# EAGLE design edcs_b (EAGLE 5.09)
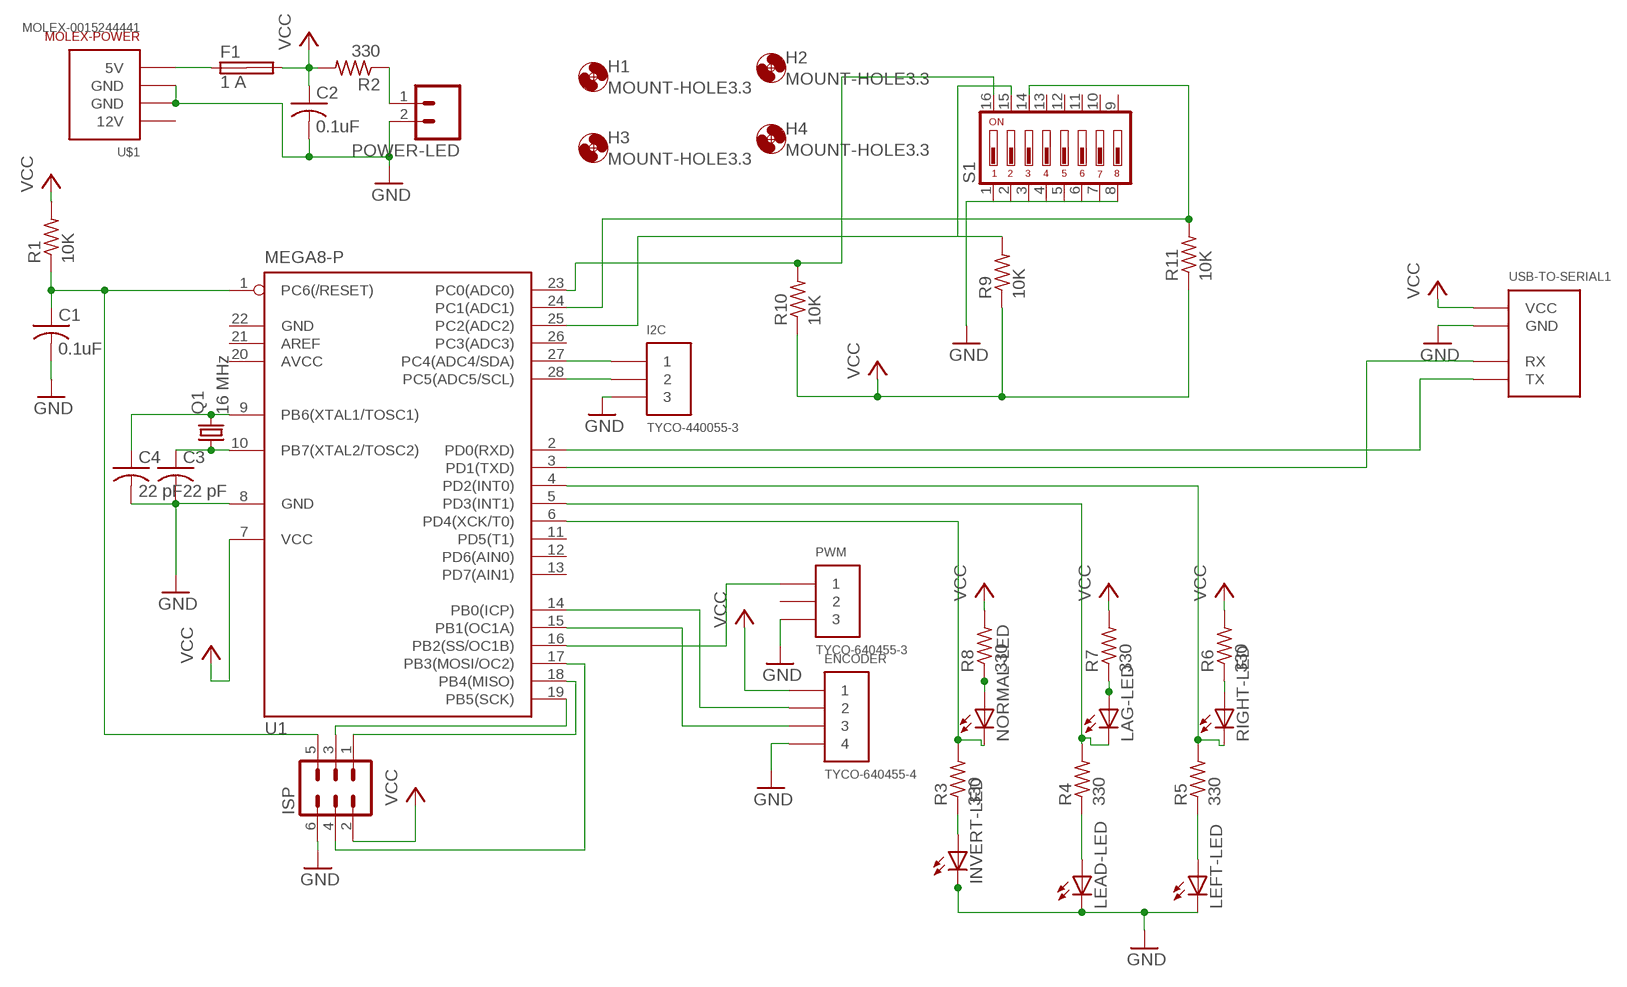
[diagram p0: schematic, sheet 1]

## Parts
C1  0.1uF  C-US050-055X075  [C050-055X075]
C2  0.1uF  C-US050-055X075  [C050-055X075]
C3  22 pF  C-US025-025X050  [C025-025X050]
C4  22 pF  C-US025-025X050  [C025-025X050]
ENCODER  TYCO-640455-4  [HEADER-RA-POL-.100IN-4]
F1  1 A  SHK20Q  [SHK20Q]
H1  MOUNT-HOLE3.3  [3,3]
H2  MOUNT-HOLE3.3  [3,3]
H3  MOUNT-HOLE3.3  [3,3]
H4  MOUNT-HOLE3.3  [3,3]
I2C  TYCO-440055-3  [HEADER-RA-2.00MM-3]
INVERT-LED  LED3MM  [LED3MM]
ISP  MA03-2  [MA03-2]
LAG-LED  LED3MM  [LED3MM]
LEAD-LED  LED3MM  [LED3MM]
LEFT-LED  LED3MM  [LED3MM]
NORMAL-LED  LED3MM  [LED3MM]
POWER-LED  M02POLAR  [MOLEX-1X2]
PWM  TYCO-640455-3  [HEADER-RA-POL-.100IN-3]
Q1  16 MHz  CRYSTALHC49S  [HC49/S]
R1  10K  R-US_0207/10  [0207/10]
R2  330  R-US_0207/10  [0207/10]
R3  330  R-US_0207/10  [0207/10]
R4  330  R-US_0207/10  [0207/10]
R5  330  R-US_0207/10  [0207/10]
R6  330  R-US_0207/10  [0207/10]
R7  330  R-US_0207/10  [0207/10]
R8  330  R-US_0207/10  [0207/10]
R9  10K  R-US_0207/10  [0207/10]
R10  10K  R-US_0207/10  [0207/10]
R11  10K  R-US_0207/10  [0207/10]
RIGHT-LED  LED3MM  [LED3MM]
S1  DIP08YL  [DIP08YL]
U1  MEGA8-P  [DIL28-3]
U$1  MOLEX-0015244441  [MOLEX-0015244441B]
USB-TO-SERIAL1  USB-TO-SERIAL-SQUARE  [USB-TO-SERIAL.SQUARE]

## Nets
GND: C1.2 C2.2 C3.2 C4.2 ENCODER.4 I2C.3 INVERT-LED.K(C) ISP.6 LEAD-LED.K(C) LEFT-LED.K(C) POWER-LED.2 PWM.3 S1.1 S1.2 S1.3 S1.4 S1.5 S1.6 S1.7 S1.8 U1.8(GND) U$1.2(GND) U$1.3(GND) USB-TO-SERIAL1.GND
N$1: C3.1 Q1.1 U1.10(PB7(XTAL2/TOSC2))
N$2: C4.1 Q1.2 U1.9(PB6(XTAL1/TOSC1))
N$3: C1.1 ISP.5 R1.1 U1.1(PC6(/RESET))
N$4: F1.1A U$1.4(5V)
N$5: ENCODER.2 U1.14(PB0(ICP))
N$6: ENCODER.3 U1.15(PB1(OC1A))
N$7: PWM.1 U1.16(PB2(SS/OC1B))
N$8: I2C.1 U1.27(PC4(ADC4/SDA))
N$9: I2C.2 U1.28(PC5(ADC5/SCL))
N$10: R9.2 S1.15 U1.25(PC2(ADC2))
N$11: R11.2 S1.14 U1.24(PC1(ADC1))
N$12: NORMAL-LED.A R8.1
N$13: R10.2 S1.16 U1.23(PC0(ADC0))
N$14: ISP.1 U1.18(PB4(MISO))
N$15: U1.2(PD0(RXD)) USB-TO-SERIAL1.TX
N$16: LAG-LED.K(C) R4.2 U1.5(PD3(INT1))
N$17: NORMAL-LED.K(C) R3.2 U1.6(PD4(XCK/T0))
N$18: LAG-LED.A R7.1
N$19: INVERT-LED.A R3.1
N$20: R5.2 RIGHT-LED.K(C) U1.4(PD2(INT0))
N$21: LEAD-LED.A R4.1
N$22: R6.1 RIGHT-LED.A
N$23: LEFT-LED.A R5.1
N$24: U1.3(PD1(TXD)) USB-TO-SERIAL1.RX
N$28: POWER-LED.1 R2.1
N$31: ISP.3 U1.19(PB5(SCK))
N$33: ISP.4 U1.17(PB3(MOSI/OC2))
VCC: C2.1 ENCODER.1 F1.2A ISP.2 R1.2 R2.2 R6.2 R7.2 R8.2 R9.1 R10.1 R11.1 U1.7(VCC) USB-TO-SERIAL1.VCC
Unconnected: F1.1B F1.2B PWM.2 S1.9 S1.10 S1.11 S1.12 S1.13 U1.11(PD5(T1)) U1.12(PD6(AIN0)) U1.13(PD7(AIN1)) U1.21(AREF) U1.26(PC3(ADC3))

## Power pins joined to a net without a drawn wire
12V: U$1.1(12V)
AVCC: U1.20(AVCC)
GND: U1.22(GND)

## Library data of the parts
C1-C4 = resistor:C-US: CAPACITOR, American symbol
ENCODER = chicagoedt:TYCO-640455-4: 4 pin right angle header with polarizing tab and .100" pitch.
F1 = fuse:SHK20Q: FUSE HOLDER 5 x 20 mm, SH contact, E1207 Buerklin 64G6061
H1-H4 = holes:MOUNT-HOLE: MOUNTING HOLE with drill center marker
I2C = chicagoedt:TYCO-440055-3: 3 pin right angle header with shroud and 2.00 mm pitch.
INVERT-LED LAG-LED LEAD-LED LEFT-LED NORMAL-LED RIGHT-LED = led:LED: LED OSRAM: - CHIPLED LG R971, LG N971, LY N971, LG Q971, LY Q971, LO R971, LY R971 LH N974, LH R974 LS Q976, LO Q976, LY Q976 LO Q996 - Hyper CHIPLED LW Q18S LB Q993, LB Q99A, LB R99A - SideLED LS A670, LO A670, LY A670, LG A670, LP A670 LB A673, LV A673, LT A673, LW A673 LH A674 LY A675 LS A676, LA A676, LO A676, LY A676, LW A676 LS A679, LY A679, LG A679 - Hyper Micro SIDELED® LS Y876, LA Y876, LO Y876, LY Y876 LT Y87S - SmartLED LW L88C, LW L88S LB L89C, LB L89S, LG L890 LS L89K, LO L89K, LY L89K LS L896, LA L896, LO L896, LY L896 - TOPLED LS T670, LO T670, LY T670, LG T670, LP T670 LSG T670, LSP T670, LSY T670, LOP T670, LYG T670 LG T671, LOG T671, LSG T671 LB T673, LV T673, LT T673, LW T673 LH T674 LS T676, LA T676, LO T676, LY T676, LB T676, LH T676, LSB T676, LW T676 LB T67C, LV T67C, LT T67C, LS T67K, LO T67K, LY T67K, LW E67C LS E67B, LA E67B, LO E67B, LY E67B, LB E67C, LV E67C, LT E67C LW T67C LS T679, LY T679, LG T679 LS T770, LO T770, LY T770, LG T770, LP T770 LB T773, LV T773, LT T773, LW T773 LH T774 LS E675, LA E675, LY E675, LS T675 LS T776, LA T776, LO T776, LY T776, LB T776 LHGB T686 LT T68C, LB T68C - Hyper Mini TOPLED® LB M676 - Mini TOPLED Santana® LG M470 LS M47K, LO M47K, LY M47K Source: http://www.osram.convergy.de LUXEON: - LUMILED® LXK2-PW12-R00, LXK2-PW12-S00, LXK2-PW14-U00, LXK2-PW14-V00 LXK2-PM12-R00, LXK2-PM12-S00, LXK2-PM14-U00 LXK2-PE12-Q00, LXK2-PE12-R00, LXK2-PE12-S00, LXK2-PE14-T00, LXK2-PE14-U00 LXK2-PB12-K00, LXK2-PB12-L00, LXK2-PB12-M00, LXK2-PB14-N00, LXK2-PB14-P00, LXK2-PB14-Q00 LXK2-PR12-L00, LXK2-PR12-M00, LXK2-PR14-Q00, LXK2-PR14-R00 LXK2-PD12-Q00, LXK2-PD12-R00, LXK2-PD12-S00 LXK2-PH12-R00, LXK2-PH12-S00 LXK2-PL12-P00, LXK2-PL12-Q00, LXK2-PL12-R00 Source: www.luxeon.com KINGBRIGHT: KA-3528ASYC Source: www.kingbright.com
ISP = con-lstb:MA03-2: PIN HEADER
POWER-LED = SparkFun:M02: Header 2 Standard 2-pin 0.1" header. Use with straight break away headers (SKU : PRT-00116), right angle break away headers (PRT-00553), swiss pins (PRT-00743), machine pins (PRT-00117), and female headers (PRT-00115). Molex polarized connector foot print use with SKU : PRT-08233 with associated crimp pins and housings.
PWM = chicagoedt:TYCO-640455-3: 3 pin right angle header with polarizing tab and .100" pitch.
Q1 = crystal:CRYSTAL: CRYSTAL
R1-R11 = resistor:R-US_: RESISTOR, American symbol
S1 = switch-dil:DIP08YL: DIL/CODE SWITCH
U1 = atmel:MEGA8-P: MICROCONTROLLER 8 Kbytes FLASH, 1 kbytes SRAM, 512 bytes EEPROM, USART, 4-channel 10 bit ADC, 2-channel 8 bit ADC Pin compatible with Atmega48, ATMega88, ATMega168 Source: avr.lbr
U$1 = chicagoedt:MOLEX-0015244441: 5.08mm (.200") Pitch Disk Drive Power Connection System Header, Right Angle, Through Hole, 4 Circuits, Lead-free, 3.56mm (.140") PC Tail Length, with PCB Locator Peg
USB-TO-SERIAL1 = chicagoedt:USB-TO-SERIAL-SQUARE

## Board
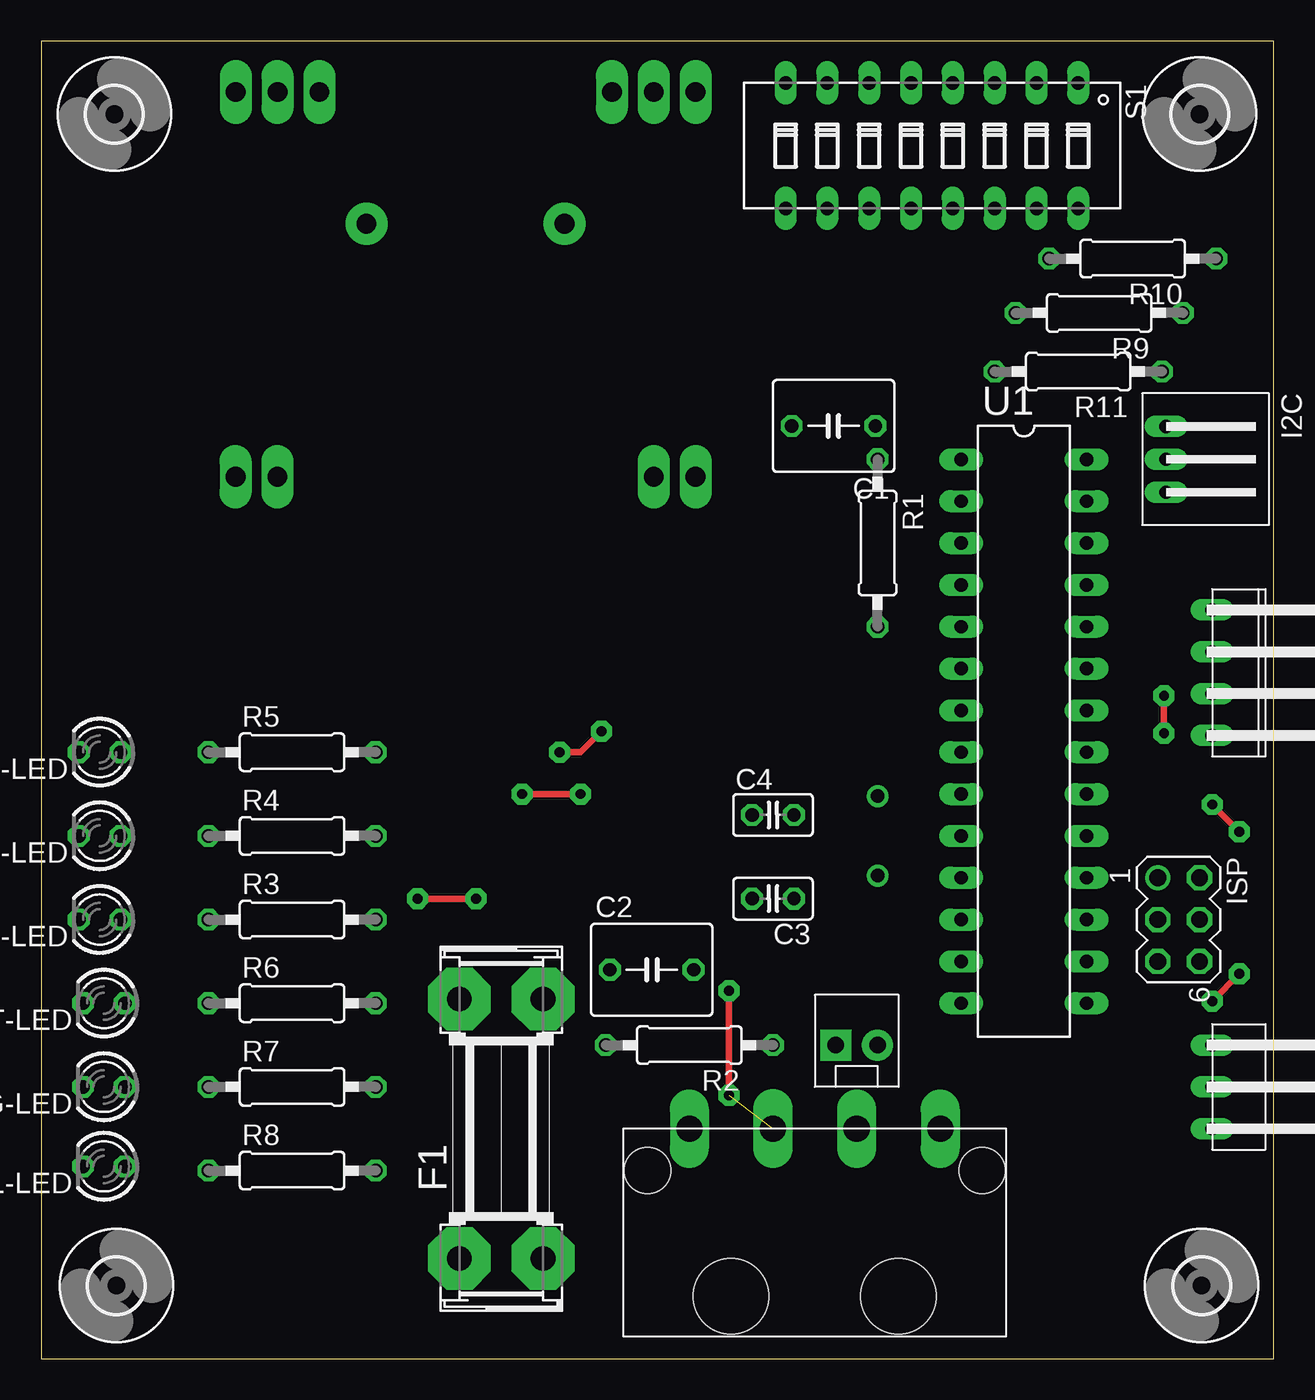
[diagram p1: board, top side]
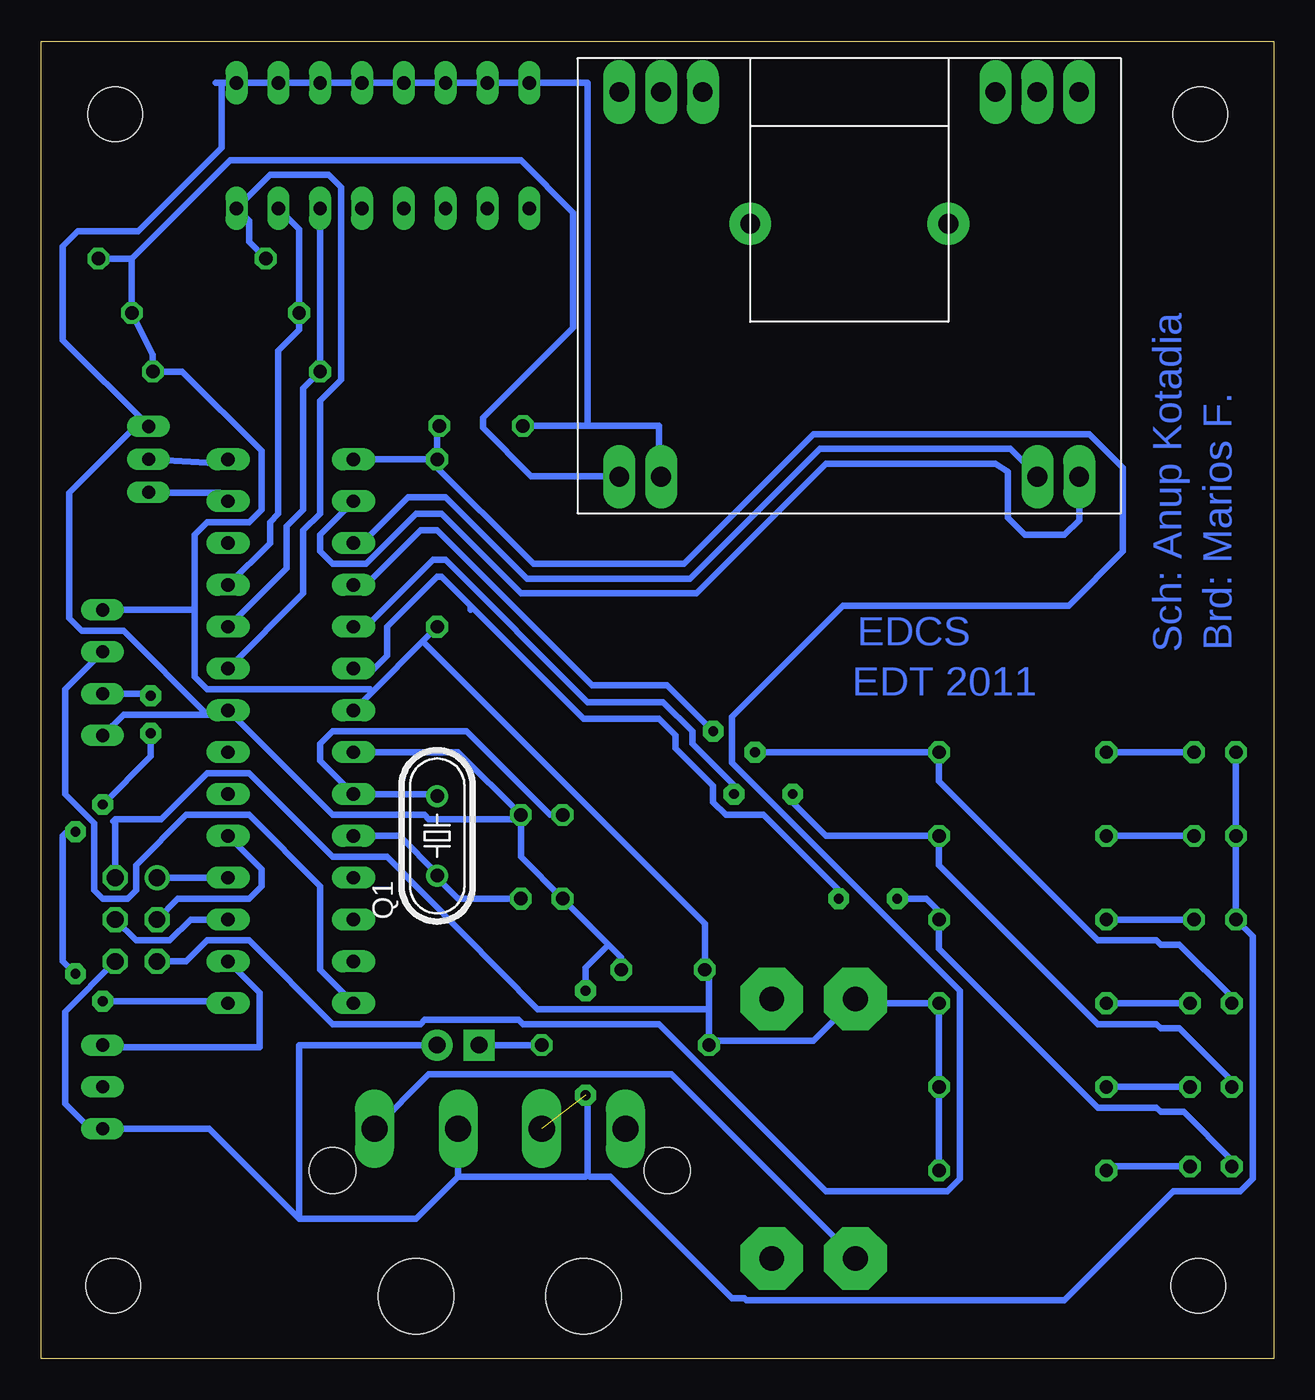
[diagram p2: board, bottom side, seen from below]

Size 74.85 x 80 mm. Coordinates in mm from the lower left corner, seen from the top.
Outline: 0,0 74.85,0 74.85,80 0,80 0,0
Copper layers (1*16): Top 0.035mm / dielectric 1.5mm / Bottom 0.035mm
Design rules "default *": minimum track width 16mil, minimum drill 24mil, track to track 16mil, track to pad 12mil, pad to pad 10mil, via to via 8mil, smd to smd 8mil, copper to edge 40mil, drill to drill 8mil, minimum pad ring 10mil, minimum via ring 8mil, stop-mask expansion 4mil, vias tented up to drill 0mil, thermal gap 10mil

### Footprints (pad centres in the part's own frame; a part is rotated, then mirrored left to right if it is on the bottom)
C050-055X075 = drill 0.813 octagon: 1 -2.54,0; 2 2.54,0
C025-025X050 = drill 0.813 octagon: 1 -1.27,0; 2 1.27,0
HEADER-RA-POL-.100IN-4 = drill 0.8 long: 1 -3.81,-5.08; 2 -1.27,-5.08; 3 1.27,-5.08; 4 3.81,-5.08
SHK20Q = drill 1.5 pad 3.81 octagon: 1A -7.874,2.54; 1B -7.874,-2.54; 2A 7.874,2.54; 2B 7.874,-2.54
3,3 = hole 3.3: 0,0
HEADER-RA-2.00MM-3 = drill 0.8 long: 1 2,0; 2 0,0; 3 -2,0
LED3MM = drill 0.813 octagon: A -1.27,0; K 1.27,0
MA03-2 = drill 1.016 round: 1 -2.54,-1.27 | drill 1.016 octagon: 2 -2.54,1.27; 3 0,-1.27; 4 0,1.27; 5 2.54,-1.27; 6 2.54,1.27
MOLEX-1X2 = drill 1.016 pad 1.88 square: 1 0,0 | drill 1.016 pad 1.88 round: 2 2.54,0
HEADER-RA-POL-.100IN-3 = drill 0.8 long: 1 -2.54,-5.08; 2 0,-5.08; 3 2.54,-5.08
HC49/S = drill 0.813 round: 1 -2.413,0; 2 2.413,0
0207/10 = drill 0.813 octagon: 1 -5.08,0; 2 5.08,0
DIP08YL = drill 0.813 long: 1 -8.89,-3.81; 2 -6.35,-3.81; 3 -3.81,-3.81; 4 -1.27,-3.81; 5 1.27,-3.81; 6 3.81,-3.81; 7 6.35,-3.81; 8 8.89,-3.81; 9 8.89,3.81; 10 6.35,3.81; 11 3.81,3.81; 12 1.27,3.81; 13 -1.27,3.81; 14 -3.81,3.81; 15 -6.35,3.81; 16 -8.89,3.81
DIL28-3 = drill 0.813 long: 1 -16.51,-3.81; 2 -13.97,-3.81; 3 -11.43,-3.81; 4 -8.89,-3.81; 5 -6.35,-3.81; 6 -3.81,-3.81; 7 -1.27,-3.81; 8 1.27,-3.81; 9 3.81,-3.81; 10 6.35,-3.81; 11 8.89,-3.81; 12 11.43,-3.81; 13 13.97,-3.81; 14 16.51,-3.81; 15 16.51,3.81; 16 13.97,3.81; 17 11.43,3.81; 18 8.89,3.81; 19 6.35,3.81; 20 3.81,3.81; 21 1.27,3.81; 22 -1.27,3.81; 23 -3.81,3.81; 24 -6.35,3.81; 25 -8.89,3.81; 26 -11.43,3.81; 27 -13.97,3.81; 28 -16.51,3.81
MOLEX-0015244441B = drill 1.587 pad 1.778 long: 1 7.62,-6.35; 3 -2.54,-6.35; 4 -7.62,-6.35 | drill 1.6 pad 1.651 long: 2 2.54,-6.35 | hole 2.794: -10.16,-3.81; 10.16,-3.81 | hole 4.572: -5.08,3.81; 5.08,3.81
USB-TO-SERIAL.SQUARE = drill 1.2 pad 1.93 long: GND 11.595,11.425; P$1 -11.76,13.965; P$2 -11.76,11.425; P$3 -11.76,8.885; P$4 -11.76,-8.885; P$7 -11.76,-11.425; P$8 -11.76,-13.965; RX 11.595,-11.435; TX 11.595,-13.975; VCC 11.595,13.965 | drill 1.2 pad 2.54 round: P$5 -3.771,-6.023; P$6 -3.771,6.01

### Placement (x,y rotation side)
C1  48.13,56.64 180 top
C2  37.08,23.62 0 top
C3  44.45,27.94 180 top
C4  44.45,33.02 0 top
ENCODER  76.2,41.66 270 top
F1  27.94,13.97 90 top
H1  70.36,75.56 0 top
H2  4.57,4.45 0 top
H3  70.48,4.45 0 top
H4  4.45,75.56 0 top
I2C  68.33,54.61 270 top
INVERT-LED  3.56,26.67 180 top
ISP  69.09,26.67 270 top
LAG-LED  3.81,16.51 180 top
LEAD-LED  3.56,31.75 180 top
LEFT-LED  3.56,36.83 180 top
NORMAL-LED  3.81,11.68 180 top
POWER-LED  48.26,19.05 0 top
PWM  76.2,16.51 270 top
Q1  50.8,31.75 90 bottom
R1  50.8,49.53 270 top
R2  39.37,19.05 180 top
R3  15.24,26.67 0 top
R4  15.24,31.75 0 top
R5  15.24,36.83 0 top
R6  15.24,21.59 0 top
R7  15.24,16.51 0 top
R8  15.24,11.43 0 top
R9  64.26,63.5 180 top
R10  66.29,66.8 180 top
R11  62.99,59.94 180 top
RIGHT-LED  3.81,21.59 180 top
S1  54.1,73.66 180 top
U1  59.69,38.1 270 top
U$1  46.99,7.62 180 top
USB-TO-SERIAL1  25.78,65.15 270 top

### Tracks (layer width: path | path; a pad name or v marks a point on that pad's centre or on a via)
GND  (via drill 0.6 pad 1.27)  (1 unrouted)
  Top 0.406: v41.78,16 v41.78,22.35
  Bottom 0.406: C2.2 39.62,24.38 40.39,25.15 | 40.39,25.15 C3.2 45.72,30.48 45.72,32.77 | U1.8 49.53,36.83 C4.2 45.72,32.77 | U1.22 57.15,33.02 51.56,33.02 51.31,32.77 45.72,32.77 | 63.88,77.47 S1.1 S1.2 S1.3 S1.4 S1.5 S1.6 S1.7 S1.8 41.66,77.47 41.66,56.64 | 63.88,77.47 64.26,77.47 | POWER-LED.2 59.18,19.05 59.18,8.51 | LEFT-LED.K LEAD-LED.K INVERT-LED.K 1.27,25.65 1.27,10.92 2.03,10.16 6.1,10.16 12.7,3.56 32,3.56 32.13,3.68 32.89,3.68 40.26,11.05 41.53,11.05 41.66,11.18 | ISP.6 73.41,21.08 73.41,15.49 71.88,13.97 PWM.3 64.64,13.97 59.18,8.51 | 64.77,39.12 63.5,39.12 U1.22 | 64.77,39.12 69.85,39.12 ENCODER.4 | 63.88,77.47 63.88,73.53 68.96,68.45 72.64,68.45 73.53,67.56 73.53,61.85 68.33,56.64 I2C.3 68.83,56.9 73.15,52.58 73.15,44.96 72.39,44.2 69.85,44.2 64.77,39.12 | 41.66,11.18 41.66,16 v41.78,16 | v41.78,22.35 41.78,23.75 40.39,25.15 | 41.66,56.64 37.34,56.64 37.34,53.59 USB-TO-SERIAL1.GND | 41.66,56.64 C1.2 | U1.22 64.77,39.12 | 49.53,11.05 41.78,11.05 41.66,11.18 | 49.53,11.05 U$1.3 | 49.53,11.05 52.07,8.51 59.18,8.51
N$1
  Bottom 0.406: C3.1 49.53,27.94 50.8,29.21 Q1.1 50.8,29.46 53.09,31.75 U1.10
N$2
  Bottom 0.406: C4.1 43.94,33.02 49.02,38.1 57.15,38.1 57.91,37.34 57.91,36.32 U1.9 50.8,34.29 Q1.2
N$3
  Bottom 0.406: 51.31,54.61 U1.1 | ISP.5 66.04,24.13 64.77,25.4 62.23,25.4 57.15,20.32 51.82,20.32 51.56,20.57 45.85,20.57 45.59,20.32 37.34,20.32 27.18,10.16 19.81,10.16 19.05,10.92 19.05,22.35 32.89,36.2 32.89,38.99 26.16,45.72 12.45,45.72 9.14,49.02 9.14,54.1 11.18,56.13 27.94,56.13 35.81,48.26 44.96,48.26 51.31,54.61 | 51.31,54.61 R1.1 50.8,56.64 C1.1
N$4
  Bottom 0.406: U$1.4 51.31,17.27 36.58,17.27 F1.1A
N$5
  Bottom 0.406: U1.14 57.91,23.62 57.91,28.7 62.23,33.02 66.04,33.02 69.09,29.97 69.09,28.45 69.6,27.94 71.12,27.94 71.63,28.45 71.63,32.51 73.41,34.29 73.41,40.64 ENCODER.2
N$6  (via drill 0.6 pad 1.27)
  Top 0.406: v71.12,21.72 v72.77,23.37 | v72.77,32 v71.12,33.66 | v68.2,37.97 v68.2,40.26
  Bottom 0.406: 71.25,21.72 v71.12,21.72 63.63,21.72 U1.15 | 73.03,32.26 73.53,31.75 73.53,24.13 v72.77,23.37 | 73.03,32.26 72.9,32.38 | 71.5,33.66 v71.12,33.66 68.2,36.58 v68.2,37.97 68.2,38.23 | 73.03,32.26 v72.77,32 | 68.2,40.64 v68.2,40.26 68.33,40.39 ENCODER.3
N$7
  Bottom 0.406: PWM.1 70.99,18.92 61.59,18.92 61.59,22.23 U1.16
N$8
  Bottom 0.406: U1.27 64.01,52.58 68.33,52.58 I2C.1
N$9
  Bottom 0.406: I2C.2 63.75,54.36 U1.28
N$10
  Bottom 0.406: S1.15 59.18,68.58 R9.2 59.18,62.48 60.45,61.21 60.45,51.31 60.96,50.8 60.96,49.53 U1.25
N$11
  Bottom 0.406: S1.14 R11.2 58.93,58.93 58.93,51.56 59.94,50.55 59.94,48.01 U1.24
N$12
  Bottom 0.406: NORMAL-LED.A 9.91,11.68 R8.1
N$13
  Bottom 0.406: R10.2 62.23,67.82 62.23,69.09 S1.16 60.96,71.88 57.4,71.88 56.64,71.12 56.64,59.44 57.91,58.17 57.91,51.31 58.93,50.29 58.93,46.48 U1.23
N$14
  Bottom 0.406: U1.18 ISP.1
N$15
  Bottom 0.406: U1.2 57.91,50.04 57.91,49.02 57.15,48.26 55.12,48.26 52.07,51.31 50.55,51.31 45.72,46.48 35.05,46.48 27.18,54.36 16.89,54.36 16.13,53.85 16.13,51.05 15.11,50.04 12.7,50.04 11.81,50.93 11.81,53.47 USB-TO-SERIAL1.TX
N$16  (via drill 0.6 pad 1.27)
  Top 0.406: v29.21,34.29 v32.77,34.29
  Bottom 0.406: U1.5 55.12,44.45 51.05,48.51 50.29,48.51 41.66,39.88 37.08,39.88 35.31,38.1 35.31,37.34 32.51,34.54 32.51,34.29 v32.77,34.29 | 28.96,34.29 v29.21,34.29 29.46,34.04 27.18,31.75 R4.2 20.32,29.97 10.67,20.32 7.11,20.32 6.86,20.07 5.71,20.07 2.54,16.89 LAG-LED.K
N$17  (via drill 0.6 pad 1.27)
  Top 0.406: v22.86,27.94 v26.42,27.94
  Bottom 0.406: 48.77,45.72 48.77,45.47 | 48.77,45.72 50.55,47.5 50.8,47.5 53.85,44.45 53.85,42.67 54.86,41.66 55.63,41.66 U1.6 | 48.77,45.72 41.91,38.86 37.34,38.86 36.32,37.85 36.32,37.08 34.04,34.8 34.04,33.78 33.27,33.02 30.99,33.02 26.16,28.19 26.16,27.94 v26.42,27.94 | v22.86,27.94 21.08,27.94 20.32,27.18 R3.2 20.32,24.89 10.67,15.24 7.11,15.24 6.86,14.99 5.46,14.99 2.54,12.06 NORMAL-LED.K
N$18
  Bottom 0.406: LAG-LED.A R7.1
N$19
  Bottom 0.406: INVERT-LED.A R3.1
N$20  (via drill 0.6 pad 1.27)
  Top 0.406: v31.5,36.83 32.77,36.83 v34.04,38.1
  Bottom 0.406: v34.04,38.1 36.83,40.89 41.4,40.89 50.8,50.29 51.82,50.29 54.86,47.24 55.63,47.24 U1.4 | v31.5,36.83 R5.2 20.32,35.05 10.67,25.4 7.11,25.4 6.86,25.15 5.71,25.15 2.54,21.97 RIGHT-LED.K
N$21
  Bottom 0.406: LEAD-LED.A R4.1
N$22
  Bottom 0.406: RIGHT-LED.A R6.1
N$23
  Bottom 0.406: LEFT-LED.A R5.1
N$24
  Bottom 0.406: U1.3 55.37,49.53 52.58,52.32 50.29,52.32 45.34,47.37 35.43,47.37 27.56,55.24 16,55.24 14.35,53.59 USB-TO-SERIAL1.RX
N$28
  Bottom 0.406: R2.1 POWER-LED.1
N$31
  Bottom 0.406: U1.19 61.47,29.72 61.47,28.7 62.23,27.94 66.55,27.94 ISP.3
N$33
  Bottom 0.406: U1.17 65.79,26.67 67.06,25.4 69.09,25.4 ISP.4
VCC
  Bottom 0.406: 69.34,66.8 R9.1 68.07,60.96 R11.1 66.29,59.94 61.47,55.12 61.47,51.56 62.23,50.8 64.77,50.8 65.53,50.04 65.53,45.47 | 69.34,66.8 R10.1 | 69.34,66.8 63.37,72.77 45.72,72.77 42.55,69.6 42.55,62.61 48.01,57.15 48.01,56.52 45.09,53.59 39.88,53.59 USB-TO-SERIAL1.VCC | ISP.2 70.36,32.51 70.48,32.64 70.36,32.77 67.56,32.77 64.77,35.56 62.23,35.56 57.15,30.48 53.85,30.48 44.7,21.21 34.29,21.21 | 54.74,40.51 U1.7 | 51.69,43.56 54.74,40.51 | 51.69,43.56 R1.2 | R8.2 R7.2 R6.2 25.4,21.59 F1.2A 27.94,19.3 34.29,19.3 | 34.29,21.21 34.29,23.37 C2.1 34.54,26.42 51.69,43.56 | 34.29,19.3 34.29,21.21 | 34.29,19.3 R2.2 | 65.53,45.47 65.53,41.4 64.77,40.64 54.86,40.64 54.74,40.51 | 65.53,45.47 ENCODER.1

### Text on the board
Bottom: Sch: Anup Kotadia | Brd: Marios F. | EDCS | EDT 2011